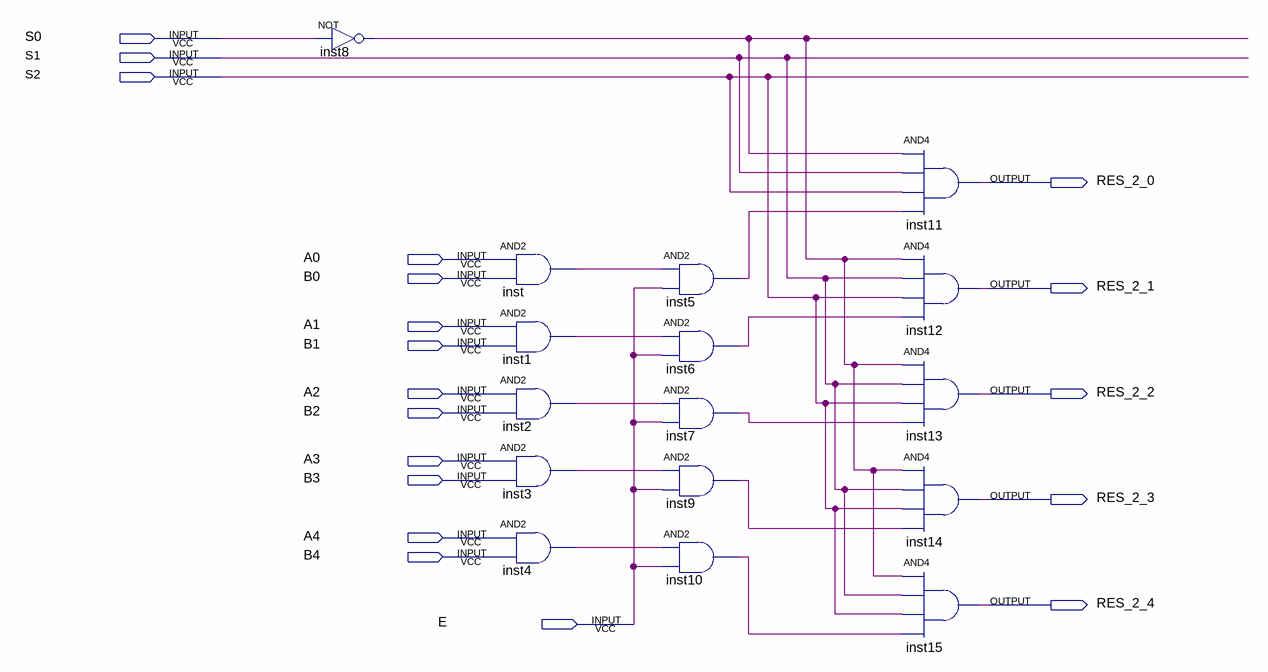
[diagram p0: schematic sheet]
// Quartus schematic MUX_AND.bdf as structural Verilog: 16 symbols, 19 pins
module MUX_AND (
  input  S0,
  input  S1,
  input  S2,
  input  A0,
  input  B0,
  input  A1,
  input  B1,
  input  A2,
  input  B2,
  input  A3,
  input  B3,
  input  A4,
  input  B4,
  input  E,
  output RES_2_0,
  output RES_2_1,
  output RES_2_2,
  output RES_2_3,
  output RES_2_4
);

  wire inst1_out, inst2_out, inst3_out, inst4_out, inst5_out, inst6_out, inst7_out, inst8_out, inst9_out,
       inst10_out, inst_out;

  not inst8 (inst8_out, S0);
  and inst (inst_out, A0, B0);
  and inst1 (inst1_out, A1, B1);
  and inst2 (inst2_out, A2, B2);
  and inst3 (inst3_out, A3, B3);
  and inst4 (inst4_out, A4, B4);
  and inst5 (inst5_out, inst_out, E);
  and inst6 (inst6_out, inst1_out, E);
  and inst7 (inst7_out, inst2_out, E);
  and inst9 (inst9_out, inst3_out, E);
  and inst10 (inst10_out, inst4_out, E);
  and inst11 (RES_2_0, inst8_out, S1, S2, inst5_out);
  and inst12 (RES_2_1, inst8_out, S1, S2, inst6_out);
  and inst13 (RES_2_2, inst8_out, S1, S2, inst7_out);
  and inst14 (RES_2_3, inst8_out, S1, S2, inst9_out);
  and inst15 (RES_2_4, inst8_out, S1, S2, inst10_out);
endmodule
